# EAGLE schematic EAA690_RFID (EAGLE 6.6.0)
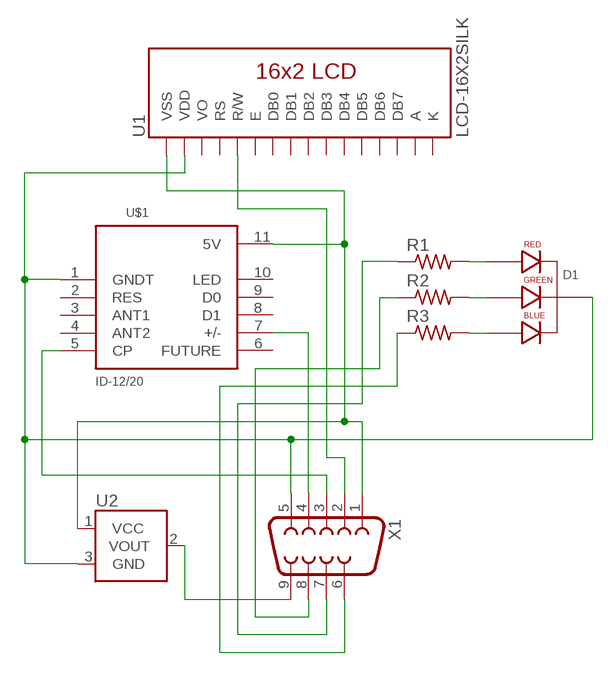
[diagram p0: schematic, sheet 1]

## Parts
D1  LED-RGB-CC-THRUDIFFUSE  [LED-RGB-THRU]
R1  R-US_0204/7  [0204/7]
R2  R-US_0204/7  [0204/7]
R3  R-US_0204/7  [0204/7]
U1  LCD-16X2SILK  [LCD-16X2]
U2  TMP36GT9  [TO-92]
U$1  ID-12/20  [ID-12]
X1  DB9FEMALE  [DB9]

## Nets
N$1: D1.2(CATHODE) U1.2(VDD) U2.3(GND) U$1.1(GNDT) X1.5
N$2: D1.4(BLUE_CATHODE) R3.2
N$3: D1.3(GREEN_CATHODE) R2.2
N$4: D1.1(RED_CATHODE) R1.2
N$5: U$1.7(+/-) X1.4
N$6: R2.1 X1.8
N$7: U1.5(R/W) X1.2
N$9: U2.2(VOUT) X1.9
N$10: U$1.5(CP) X1.3
N$11: R1.1 X1.7
N$12: R3.1 X1.6
N$14: U1.1(VSS) U2.1(VCC) U$1.11(5V) X1.1
Unconnected: U1.3(VO) U1.4(RS) U1.6(E) U1.7(DB0) U1.8(DB1) U1.9(DB2) U1.10(DB3) U1.11(DB4) U1.12(DB5) U1.13(DB6) U1.14(DB7) U$1.2(RES) U$1.3(ANT1) U$1.4(ANT2) U$1.6(FUTURE) U$1.8(D1) U$1.9(D0) U$1.10(LED)

## Power pins joined to a net without a drawn wire
A: U1.15(A)
K: U1.16(K)

## Library data of the parts
D1 = SparkFun-LED:LED-RGB-CC-THRU: RGB Through-hole common cathode LED SparkFun Storefront: COM-00105 (Clear) COM-09264 (Diffuse); PROD_ID: DIO-09434
R1-R3 = resistor:R-US_: RESISTOR, American symbol
U1 = SparkFun-Displays:LCD-16X2: Standard text-only 16x2 parallel input LCD
U2 = SparkFun-Sensors:TMP36: Precision degC temp sensor, analog out
U$1 = SparkFun-RF:ID-12/20: RFID reader for ID2, ID12, and ID20 Package
X1 = SparkFun-Connectors:DB9: DB9 Connector Standard DB9 (D-Sub 9) serial connector. Can be used for CAN bus as well as RS485 and RS232. Footprint production proven. Spark Fun Electronics SKU : PRT-00429